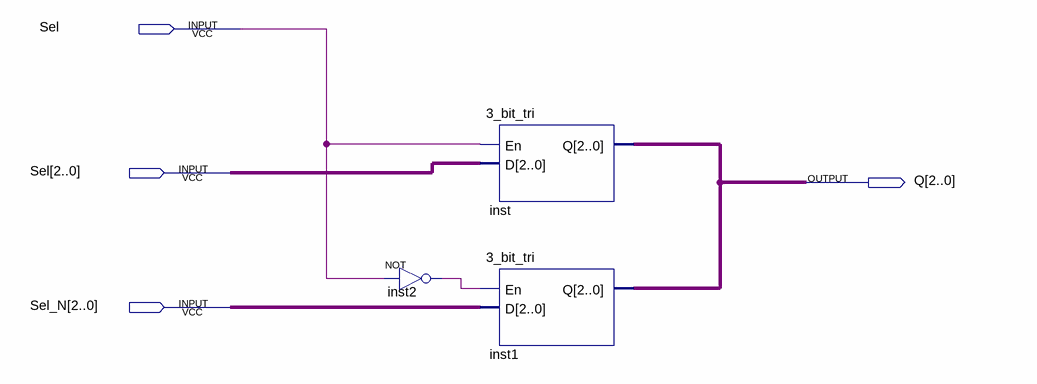
[diagram p0: schematic sheet]
// Quartus schematic 3bit_2_1_MUX.bdf as structural Verilog: 3 symbols, 4 pins
module \3bit_2_1_MUX  (
  input  Sel_1bit,
  input  [2:0] Sel,
  input  [2:0] Sel_N,
  output [2:0] Q
);

  wire inst2_out;

  not inst2 (inst2_out, Sel_1bit);
  \3_bit_tri  inst (.En(Sel_1bit), .D(Sel), .Q(Q));
  \3_bit_tri  inst1 (.En(inst2_out), .D(Sel_N), .Q(Q));
endmodule
